# EAGLE design OPA381 (EAGLE 7.3.0)
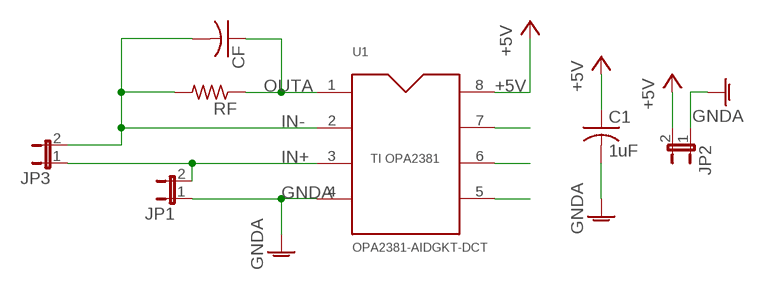
[diagram p0: schematic, sheet 1]

## Parts
C1  1uF  C-USC0603  [C0603]
CF  C-USC0603  [C0603]
JP1  JP1E  [JP1]
JP2  JP1E  [JP1]
JP3  JP1E  [JP1]
RF  R-US_R0603  [R0603]
U1  OPA2381-AIDGKT-DCT  [SSOP8]

## Nets
+5V: C1.1 JP2.2 U1.8
GNDA: C1.2 JP1.1 JP2.1 U1.4
IN+: JP1.2 JP3.1 U1.3
IN-: CF.2 JP3.2 RF.2 U1.2
N$1: U1.7
N$5: U1.6
N$6: U1.5
OUTA: CF.1 RF.1 U1.1

## Library data of the parts
C1 CF = rcl:C-US: CAPACITOR, American symbol
JP1-JP3 = jumper:JP1E: JUMPER
RF = rcl:R-US_: RESISTOR, American symbol
U1 = OPA2381:OPA2381-AIDGKT: Ti's OPA2381 Transimpedance 18MHz

## Board
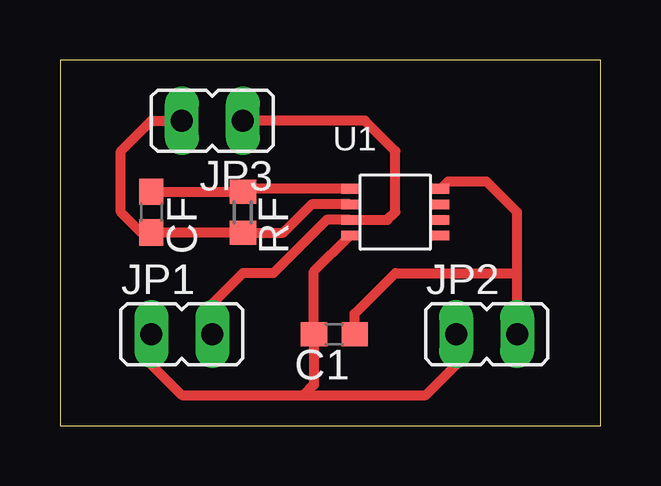
[diagram p1: board, top side]

Size 22.53 x 15.23 mm. Coordinates in mm from the lower left corner, seen from the top.
Outline: 0,0 22.53,0 22.53,15.23 0,15.23 0,0
Copper layers (1*16): Top 0.035mm / dielectric 1.5mm / Bottom 0.035mm
Design rules "default": minimum track width 10mil, minimum drill 24mil, track to track 8mil, track to pad 8mil, pad to pad 8mil, via to via 8mil, smd to smd 8mil, copper to edge 40mil, drill to drill 8mil, minimum pad ring 10mil, minimum via ring 8mil, stop-mask expansion 4mil, vias tented up to drill 0mil, thermal gap 10mil

### Footprints (pad centres in the part's own frame; a part is rotated, then mirrored left to right if it is on the bottom)
C0603 = smd 1.1 x 1: 1 -0.85,0; 2 0.85,0
JP1 = drill 0.914 long: 1 0,-1.27; 2 0,1.27
R0603 = smd 1 x 1.1: 1 -0.85,0; 2 0.85,0
SSOP8 = smd 0.4 x 0.7: 1 -0.975,-1.9; 2 -0.325,-1.9; 3 0.325,-1.9; 4 0.975,-1.9; 5 0.975,1.9; 6 0.325,1.9; 7 -0.325,1.9; 8 -0.975,1.9

### Placement (x,y rotation side)
C1  11.43,3.81 180 top
CF  3.81,8.89 270 top
JP1  5.08,3.81 270 top
JP2  17.78,3.81 270 top
JP3  6.35,12.7 90 top
RF  7.62,8.89 270 top
U1  13.97,8.89 270 top

### Tracks (layer width: path | path; a pad name or v marks a point on that pad's centre or on a via)
+5V
  Top 0.406: JP2.2 19.05,6.35 | 19.05,6.35 19.05,8.89 17.78,10.16 16.16,10.16 U1.8 | C1.1 12.28,4.66 13.97,6.35 19.05,6.35
GNDA
  Top 0.406: JP1.1 3.81,2.54 5.08,1.27 10.16,1.27 | 10.16,1.27 15.24,1.27 16.51,2.54 JP2.1 | 10.16,1.27 10.58,1.69 C1.2 10.58,6.42 U1.4
IN+
  Top 0.406: JP1.2 6.35,5.08 7.62,6.35 8.89,6.35 11.11,8.56 U1.3 13.64,8.56 13.97,8.89 13.97,11.43 12.7,12.7 JP3.1
IN-
  Top 0.406: U1.2 10.48,9.21 9.31,8.04 RF.2 CF.2 3.39,8.04 2.54,8.89 2.54,11.43 3.81,12.7 JP3.2
OUTA
  Top 0.406: CF.1 RF.1 7.75,9.87 U1.1